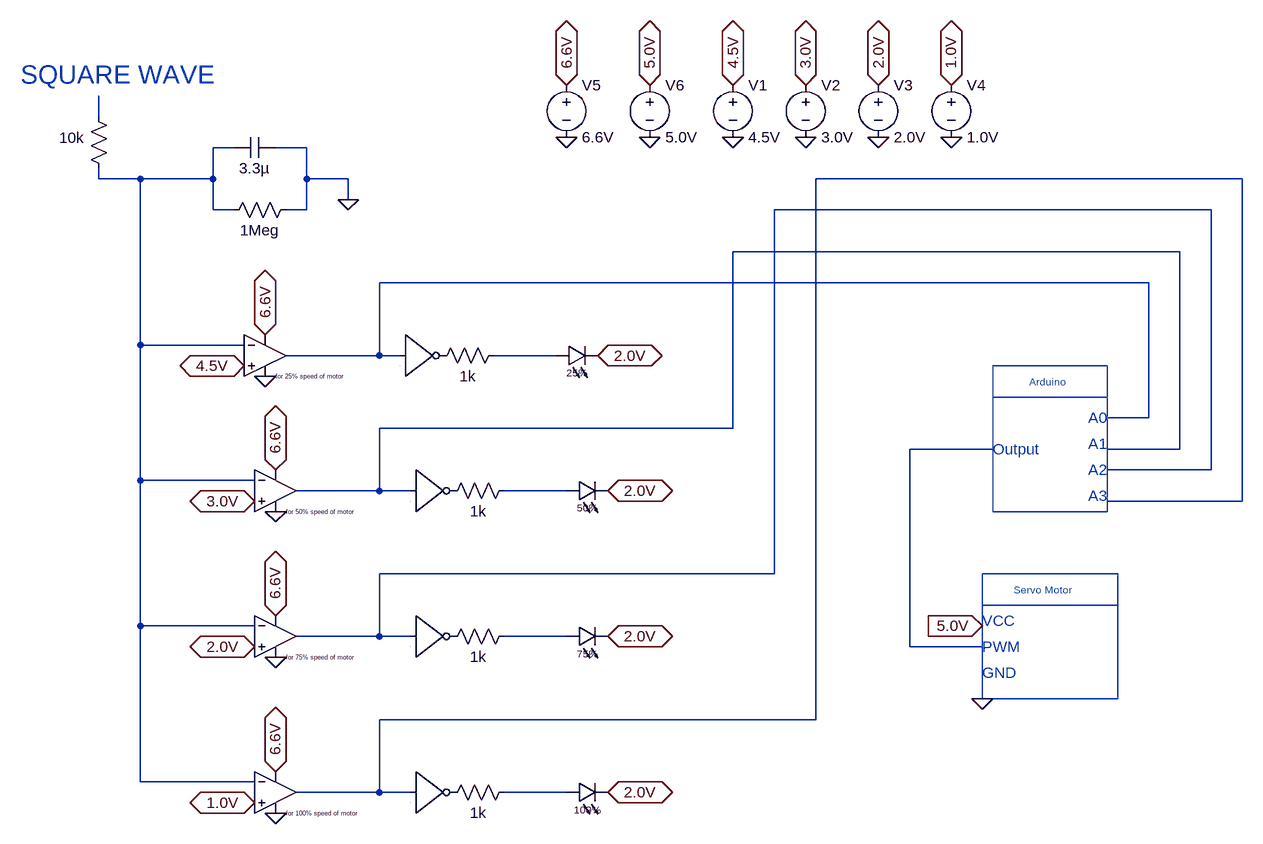
[diagram p0: schematic Speedometer.asc]
Speedometer.asc, the LTspice schematic file:
Version 4
SHEET 1 1872 856
WIRE -128 -272 -128 -304
WIRE 80 -224 48 -224
WIRE 192 -224 144 -224
WIRE -128 -176 -128 -192
WIRE -64 -176 -128 -176
WIRE 48 -176 48 -224
WIRE 48 -176 -64 -176
WIRE 192 -176 192 -224
WIRE 256 -176 192 -176
WIRE 1632 -176 976 -176
WIRE 256 -144 256 -176
WIRE 48 -128 48 -176
WIRE 80 -128 48 -128
WIRE 192 -128 192 -176
WIRE 192 -128 160 -128
WIRE 1584 -128 912 -128
WIRE 1536 -64 848 -64
WIRE 1488 -16 304 -16
WIRE -64 80 -64 -176
WIRE 96 80 -64 80
WIRE 304 96 304 -16
WIRE 304 96 160 96
WIRE 336 96 304 96
WIRE 576 96 480 96
WIRE 1488 192 1488 -16
WIRE 1488 192 1424 192
WIRE 848 208 848 -64
WIRE 848 208 304 208
WIRE 1248 240 1120 240
WIRE 1536 240 1536 -64
WIRE 1536 240 1424 240
WIRE 1584 272 1584 -128
WIRE 1584 272 1424 272
WIRE -64 288 -64 80
WIRE 112 288 -64 288
WIRE 304 304 304 208
WIRE 304 304 176 304
WIRE 352 304 304 304
WIRE 592 304 496 304
WIRE 1632 320 1632 -176
WIRE 1632 320 1424 320
WIRE 912 432 912 -128
WIRE 912 432 304 432
WIRE -64 512 -64 288
WIRE 112 512 -64 512
WIRE 304 528 304 432
WIRE 304 528 176 528
WIRE 352 528 304 528
WIRE 592 528 496 528
WIRE 1120 544 1120 240
WIRE 1232 544 1120 544
WIRE 976 656 976 -176
WIRE 976 656 304 656
WIRE -64 752 -64 512
WIRE 112 752 -64 752
WIRE 304 768 304 656
WIRE 304 768 176 768
WIRE 352 768 304 768
WIRE 592 768 496 768
FLAG 848 -240 0
FLAG 960 -240 0
FLAG 1072 -240 0
FLAG 1184 -240 0
FLAG 848 -320 4.5V
IOPIN 848 -320 BiDir
FLAG 96 112 4.5V
IOPIN 96 112 BiDir
FLAG 960 -320 3.0V
IOPIN 960 -320 BiDir
FLAG 112 320 3.0V
IOPIN 112 320 BiDir
FLAG 1072 -320 2.0V
IOPIN 1072 -320 BiDir
FLAG 112 544 2.0V
IOPIN 112 544 BiDir
FLAG 1184 -320 1.0V
IOPIN 1184 -320 BiDir
FLAG 112 784 1.0V
IOPIN 112 784 BiDir
FLAG 592 -240 0
FLAG 592 -320 6.6V
IOPIN 592 -320 BiDir
FLAG 128 64 6.6V
IOPIN 128 64 BiDir
FLAG 144 272 6.6V
IOPIN 144 272 BiDir
FLAG 144 496 6.6V
IOPIN 144 496 BiDir
FLAG 144 736 6.6V
IOPIN 144 736 BiDir
FLAG 144 560 0
FLAG 144 800 0
FLAG 144 336 0
FLAG 128 128 0
FLAG 640 96 2.0V
IOPIN 640 96 BiDir
FLAG 656 304 2.0V
IOPIN 656 304 BiDir
FLAG 656 528 2.0V
IOPIN 656 528 BiDir
FLAG 656 768 2.0V
IOPIN 656 768 BiDir
FLAG 256 -144 0
FLAG 720 -240 0
FLAG 720 -320 5.0V
IOPIN 720 -320 BiDir
FLAG 1232 624 0
FLAG 1232 512 5.0V
IOPIN 1232 512 In
SYMBOL OpAmps\\opamp2 128 32 R0
WINDOW 3 16 96 Left 0
WINDOW 0 16 32 Invisible 2
SYMATTR Value for 25% speed of motor
SYMATTR InstName U1
SYMBOL OpAmps\\opamp2 144 240 R0
WINDOW 3 16 96 Left 0
WINDOW 0 16 32 Invisible 2
SYMATTR Value for 50% speed of motor
SYMATTR InstName U2
SYMBOL OpAmps\\opamp2 144 464 R0
WINDOW 3 16 96 Left 0
WINDOW 0 16 32 Invisible 2
SYMATTR Value for 75% speed of motor
SYMATTR InstName U3
SYMBOL OpAmps\\opamp2 144 704 R0
WINDOW 3 16 96 Left 0
WINDOW 0 16 32 Invisible 2
SYMATTR Value for 100% speed of motor
SYMATTR InstName U4
SYMBOL voltage 848 -336 R0
WINDOW 123 0 0 Left 0
WINDOW 39 0 0 Left 0
SYMATTR InstName V1
SYMATTR Value 4.5V
SYMBOL voltage 960 -336 R0
WINDOW 123 0 0 Left 0
WINDOW 39 0 0 Left 0
SYMATTR InstName V2
SYMATTR Value 3.0V
SYMBOL voltage 1072 -336 R0
WINDOW 123 0 0 Left 0
WINDOW 39 0 0 Left 0
SYMATTR InstName V3
SYMATTR Value 2.0V
SYMBOL voltage 1184 -336 R0
WINDOW 123 0 0 Left 0
WINDOW 39 0 0 Left 0
SYMATTR InstName V4
SYMATTR Value 1.0V
SYMBOL Digital\\inv 336 32 R0
WINDOW 0 8 32 Invisible 2
SYMATTR InstName A1
SYMBOL Digital\\inv 352 240 R0
WINDOW 0 8 32 Invisible 2
SYMATTR InstName A2
SYMBOL Digital\\inv 352 464 R0
WINDOW 0 8 32 Invisible 2
SYMATTR InstName A3
SYMBOL Digital\\inv 352 704 R0
WINDOW 0 8 32 Invisible 2
SYMATTR InstName A4
SYMBOL res 496 80 R90
WINDOW 0 0 56 Invisible 2
WINDOW 3 32 56 VTop 2
SYMATTR InstName R1
SYMATTR Value 1k
SYMBOL res 512 288 R90
WINDOW 0 0 56 Invisible 2
WINDOW 3 32 56 VTop 2
SYMATTR InstName R2
SYMATTR Value 1k
SYMBOL res 512 512 R90
WINDOW 0 0 56 Invisible 2
WINDOW 3 32 56 VTop 2
SYMATTR InstName R3
SYMATTR Value 1k
SYMBOL res 512 752 R90
WINDOW 0 0 56 Invisible 2
WINDOW 3 32 56 VTop 2
SYMATTR InstName R4
SYMATTR Value 1k
SYMBOL LED 576 112 R270
WINDOW 0 72 32 Invisible 2
WINDOW 3 0 32 VBottom 1
SYMATTR InstName .
SYMATTR Value 25%
SYMBOL LED 592 320 R270
WINDOW 0 72 32 Invisible 2
WINDOW 3 0 32 VBottom 1
SYMATTR InstName .
SYMATTR Value 50%
SYMBOL LED 592 544 R270
WINDOW 0 72 32 Invisible 1
WINDOW 3 0 32 VBottom 1
SYMATTR InstName .
SYMATTR Value 75%
SYMBOL LED 592 784 R270
WINDOW 0 72 32 Invisible 2
WINDOW 3 0 32 VBottom 1
SYMATTR InstName .
SYMATTR Value 100%
SYMBOL voltage 592 -336 R0
WINDOW 123 0 0 Left 0
WINDOW 39 0 0 Left 0
SYMATTR InstName V5
SYMATTR Value 6.6V
SYMBOL res -112 -176 R180
WINDOW 0 36 76 Invisible 2
WINDOW 3 57 63 Center 2
SYMATTR InstName R5
SYMATTR Value 10k
SYMBOL res 176 -144 R90
WINDOW 0 0 56 Invisible 2
WINDOW 3 32 56 VTop 2
SYMATTR InstName R6
SYMATTR Value 1Meg
SYMBOL cap 144 -240 R90
WINDOW 0 0 32 Invisible 2
WINDOW 3 32 32 VTop 2
SYMATTR InstName C1
SYMATTR Value 3.3µ
SYMBOL voltage 720 -336 R0
WINDOW 123 0 0 Left 0
WINDOW 39 0 0 Left 0
SYMATTR InstName V6
SYMATTR Value 5.0V
TEXT -248 -336 Left 4 ;SQUARE WAVE
TEXT 1280 456 Left 1 ;Servo Motor
TEXT 1304 136 Left 1 ;Arduino
TEXT 1232 504 Left 2 ;VCC
TEXT 1232 544 Left 2 ;PWM
TEXT 1232 584 Left 2 ;GND
TEXT 1248 240 Left 2 ;Output
TEXT 1424 192 Right 2 ;A0
TEXT 1424 232 Right 2 ;A1
TEXT 1424 272 Right 2 ;A2
TEXT 1424 312 Right 2 ;A3
RECTANGLE Normal 1440 624 1232 432
RECTANGLE Normal 1440 480 1232 432
RECTANGLE Normal 1424 160 1248 112
RECTANGLE Normal 1424 336 1248 160

The netlist it stands for:
* Speedometer.asc
XU1 4.5V N002 6.6V 0 N006 for 25% speed of motor  ; pins In+ In- V+ V- OUT
XU2 3.0V N002 6.6V 0 N005 for 50% speed of motor  ; pins In+ In- V+ V- OUT
XU3 2.0V N002 6.6V 0 N004 for 75% speed of motor  ; pins In+ In- V+ V- OUT
XU4 1.0V N002 6.6V 0 N003 for 100% speed of motor  ; pins In+ In- V+ V- OUT
V1 4.5V 0 4.5V
V2 3.0V 0 3.0V
V3 2.0V 0 2.0V
V4 1.0V 0 1.0V
A1 N006 0 0 0 0 P001 0 0 BUF
A2 N005 0 0 0 0 P002 0 0 BUF
A3 N004 0 0 0 0 P003 0 0 BUF
A4 N003 0 0 0 0 P004 0 0 BUF
R1 N007 P001 1k
R2 N009 P002 1k
R3 N010 P003 1k
R4 N011 P004 1k
D§. N007 2.0V 25%
D§. N009 2.0V 50%
D§. N010 2.0V 75%
D§. N011 2.0V 100%
V5 6.6V 0 6.6V
R5 N002 N001 10k
R6 0 N002 1Meg
C1 0 N002 3.3µ
V6 5.0V 0 5.0V
.model D D
.lib standard.dio
* SQUARE WAVE
* Servo Motor
* Arduino
* VCC
* PWM
* GND
* Output
* A0
* A1
* A2
* A3
.backanno
.end